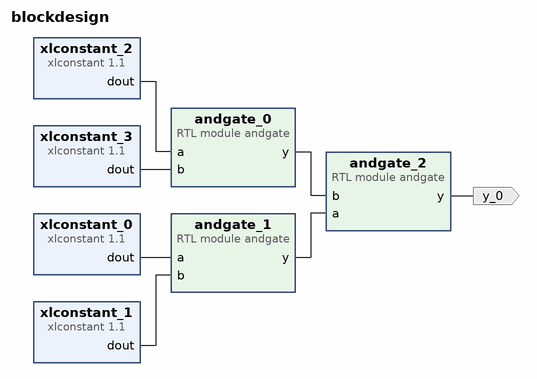
[diagram p0: block diagram of the top level]
# Vivado block design blockdesign, xc7a35tftg256-1, Vivado 2024.2
create_bd_design blockdesign

create_bd_port -dir O y_0

create_bd_cell -type module -reference andgate andgate_0
create_bd_cell -type module -reference andgate andgate_1
create_bd_cell -type module -reference andgate andgate_2
create_bd_cell -type ip -vlnv xilinx.com:ip:xlconstant:1.1 xlconstant_0
create_bd_cell -type ip -vlnv xilinx.com:ip:xlconstant:1.1 xlconstant_1
create_bd_cell -type ip -vlnv xilinx.com:ip:xlconstant:1.1 xlconstant_2
create_bd_cell -type ip -vlnv xilinx.com:ip:xlconstant:1.1 xlconstant_3

# ---- connections ----

connect_bd_net [get_bd_pins andgate_0/y] [get_bd_pins andgate_2/b]
connect_bd_net [get_bd_pins andgate_1/y] [get_bd_pins andgate_2/a]
connect_bd_net [get_bd_pins andgate_2/y] [get_bd_ports y_0]
connect_bd_net [get_bd_pins xlconstant_0/dout] [get_bd_pins andgate_1/a]
connect_bd_net [get_bd_pins xlconstant_1/dout] [get_bd_pins andgate_1/b]
connect_bd_net [get_bd_pins xlconstant_2/dout] [get_bd_pins andgate_0/a]
connect_bd_net [get_bd_pins xlconstant_3/dout] [get_bd_pins andgate_0/b]

validate_bd_design
save_bd_design
